# EAGLE schematic shield 2 (EAGLE 5.06)
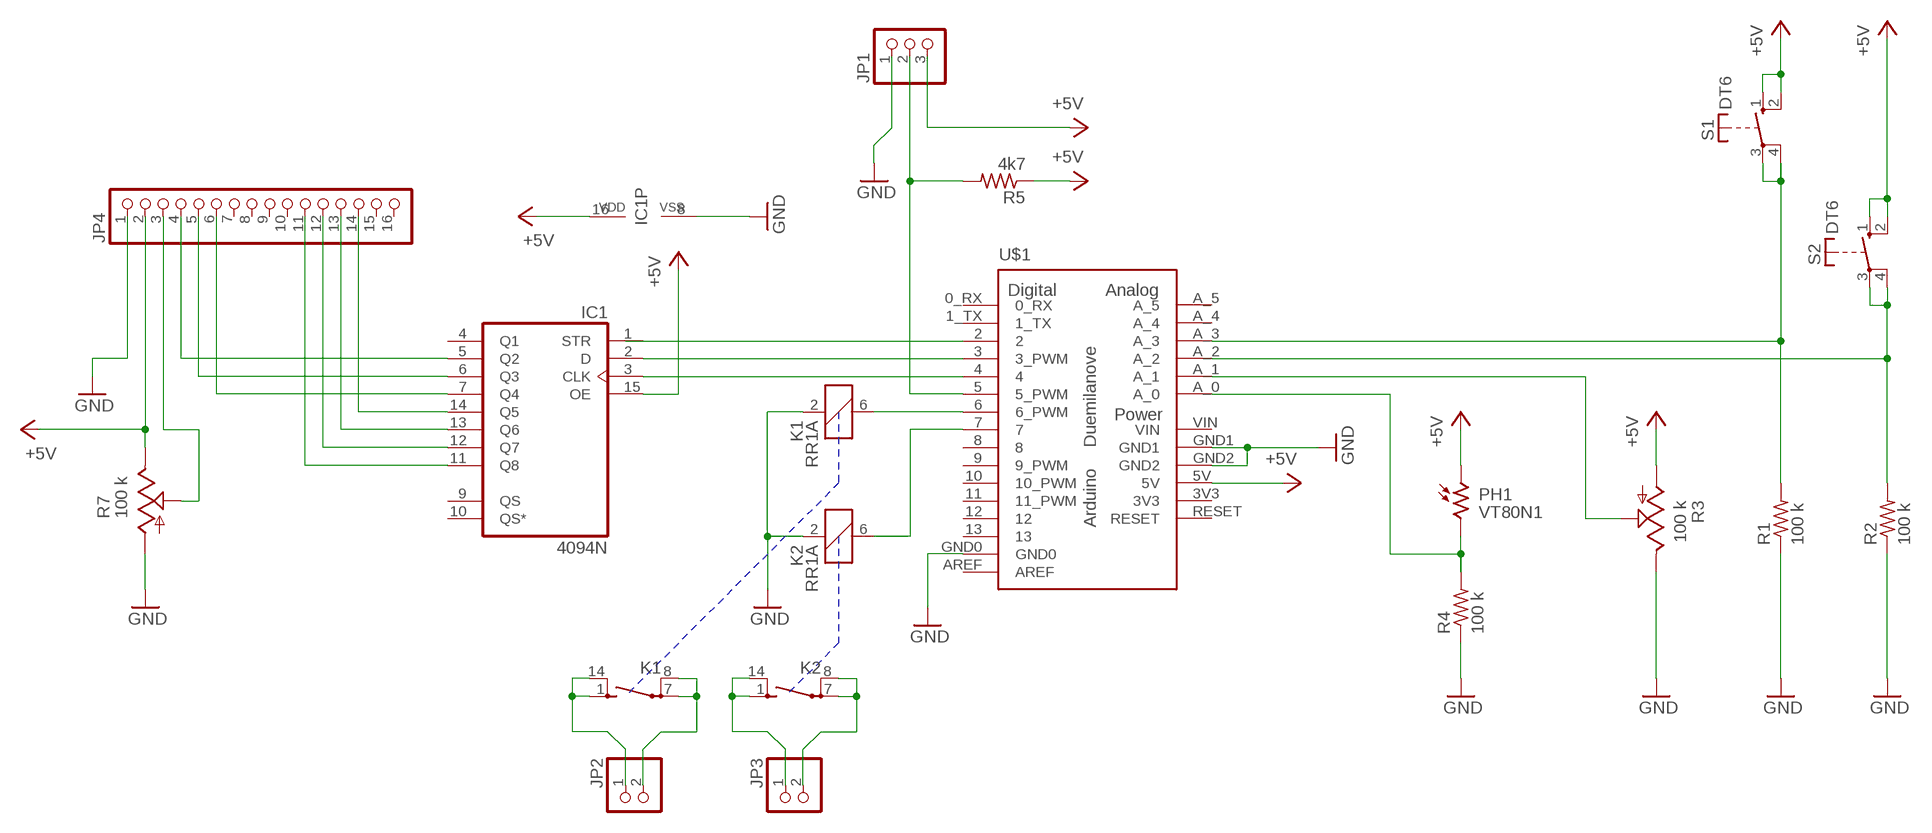
[diagram p0: schematic, sheet 1]

## Parts
IC1  4094N  [DIL16]
JP1  PINHD-1X3  [1X03]
JP2  PINHD-1X2  [1X02]
JP3  PINHD-1X2  [1X02]
JP4  PINHD-1X16  [1X16]
K1  RR1A  [RR1A]
K2  RR1A  [RR1A]
PH1  VT80N1  [VT800]
R1  100 k  R-US_0207/10  [0207/10]
R2  100 k  R-US_0207/10  [0207/10]
R3  100 k  TRIM_US-B25V  [B25V]
R4  100 k  R-US_0207/10  [0207/10]
R5  4k7  R-US_0207/10  [0207/10]
R7  100 k  TRIM_US-S64W  [S64W]
S1  DT6  [DT6]
S2  DT6  [DT6]
U$1  ARDUINO-USBLONG_PADS_TEXT  [SHIELD]

## Nets
+5V: IC1.15(OE) IC1.16(VDD) JP1.3 JP4.2 PH1.1 R3.A R5.1 R7.E S1.1(S) S1.2(S) S2.1(S) S2.2(S) U$1.5V
GND: IC1.8(VSS) JP1.1 JP4.1 K1.2 K2.2 R1.1 R2.1 R3.E R4.1 R7.A U$1.GND0 U$1.GND1 U$1.GND2
N$1: IC1.1(STR) U$1.2
N$2: IC1.3(CLK) U$1.4
N$3: IC1.2(D) U$1.3(3_PWM)
N$4: K1.6 U$1.6(6_PWM)
N$5: K2.6 U$1.7
N$6: JP2.1 K1.1(2:S) K1.14(2:S)
N$7: JP2.2 K1.7(2:P) K1.8(2:P)
N$8: JP3.1 K2.1(2:S) K2.14(2:S)
N$9: JP3.2 K2.7(2:P) K2.8(2:P)
N$10: R1.2 S1.3(P) S1.4(P) U$1.A_3
N$11: R3.S U$1.A_1
N$12: R2.2 S2.3(P) S2.4(P) U$1.A_2
N$13: PH1.2 R4.2 U$1.A_0
N$14: IC1.11(Q8) JP4.11
N$15: IC1.12(Q7) JP4.12
N$16: IC1.13(Q6) JP4.13
N$17: IC1.14(Q5) JP4.14
N$18: IC1.5(Q2) JP4.4
N$19: IC1.6(Q3) JP4.5
N$20: IC1.7(Q4) JP4.6
N$21: JP4.3 R7.S
N$22: JP1.2 R5.2 U$1.5(5_PWM)
Unconnected: IC1.4(Q1) IC1.9(QS) IC1.10(QS*) JP4.7 JP4.8 JP4.9 JP4.10 JP4.15 JP4.16 U$1.0_RX U$1.1_TX U$1.8 U$1.9(9_PWM) U$1.10(10_PWM) U$1.11(11_PWM) U$1.12 U$1.13 U$1.A_4 U$1.A_5 U$1.AREF U$1.RESET

## Buses
B$1
B$2

## Power pins joined to a net without a drawn wire
3V3: U$1.3V3
VIN: U$1.VIN

## Library data of the parts
IC1 = 40xx:4094: 8-stage SHIFT/STORE REGISTER, tri-state
JP1 = pinhead:PINHD-1X3: PIN HEADER
JP2 JP3 = pinhead:PINHD-1X2: PIN HEADER
JP4 = pinhead:PINHD-1X16: PIN HEADER
K1 K2 = relay:RR1A: RELAY reed, polarity, 1 x norm. open with shield
PH1 = photo-elements:VT8: Photoconductive Cell VT800 Series Source: http://optoelectronics.perkinelmer.com/content/Datasheets/DTS_vt800seriesdatasheet.pdf
R1 R2 R4 R5 = rcl:R-US_: RESISTOR, American symbol
R3 R7 = pot:TRIM_US-: POTENTIOMETER
S1 S2 = switch-misc:DT: ITT SWITCH
U$1 = Arduino-Various:ARDUINO-USB: The Ardiuno Duemilanove Pinouts layoutet as a Bare Shield. v0.5 Also for Arduino Diecimila. This is designed as a Part and has no Outline in the Dimension Layer. The Outline, when present, is drawed at the tPlace / bPlace Layer. Library by Stephanie Lange, http://www.k-ita.de/~sl/